# EAGLE schematic Titan_Teknic_v1p01b (EAGLE 9.6.2)
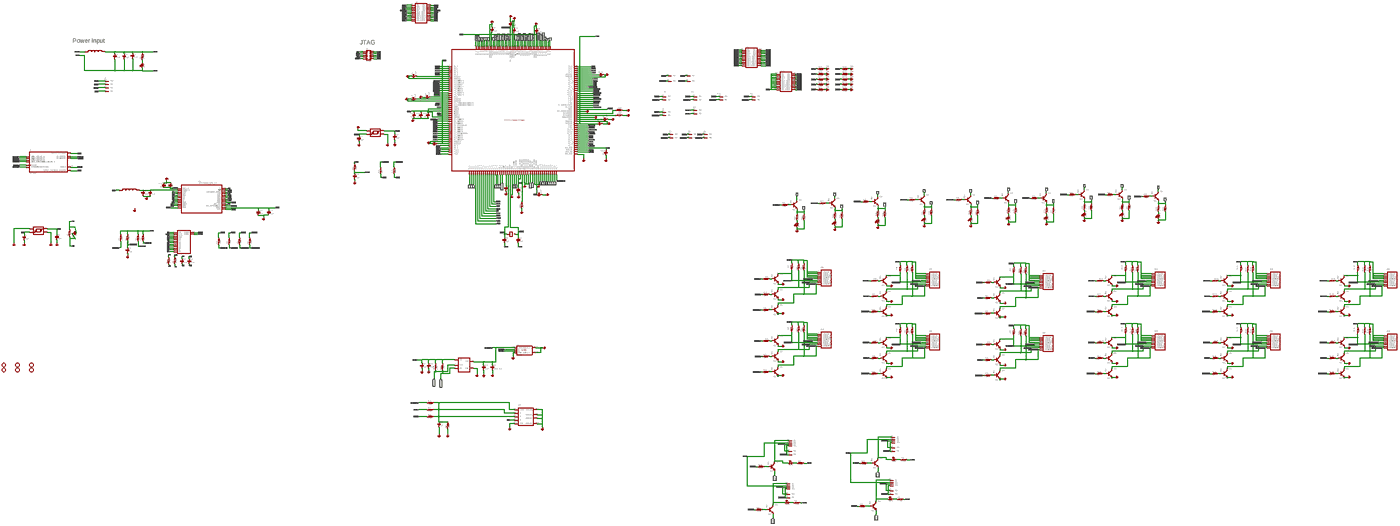
[diagram p0: schematic, sheet 1, overview]
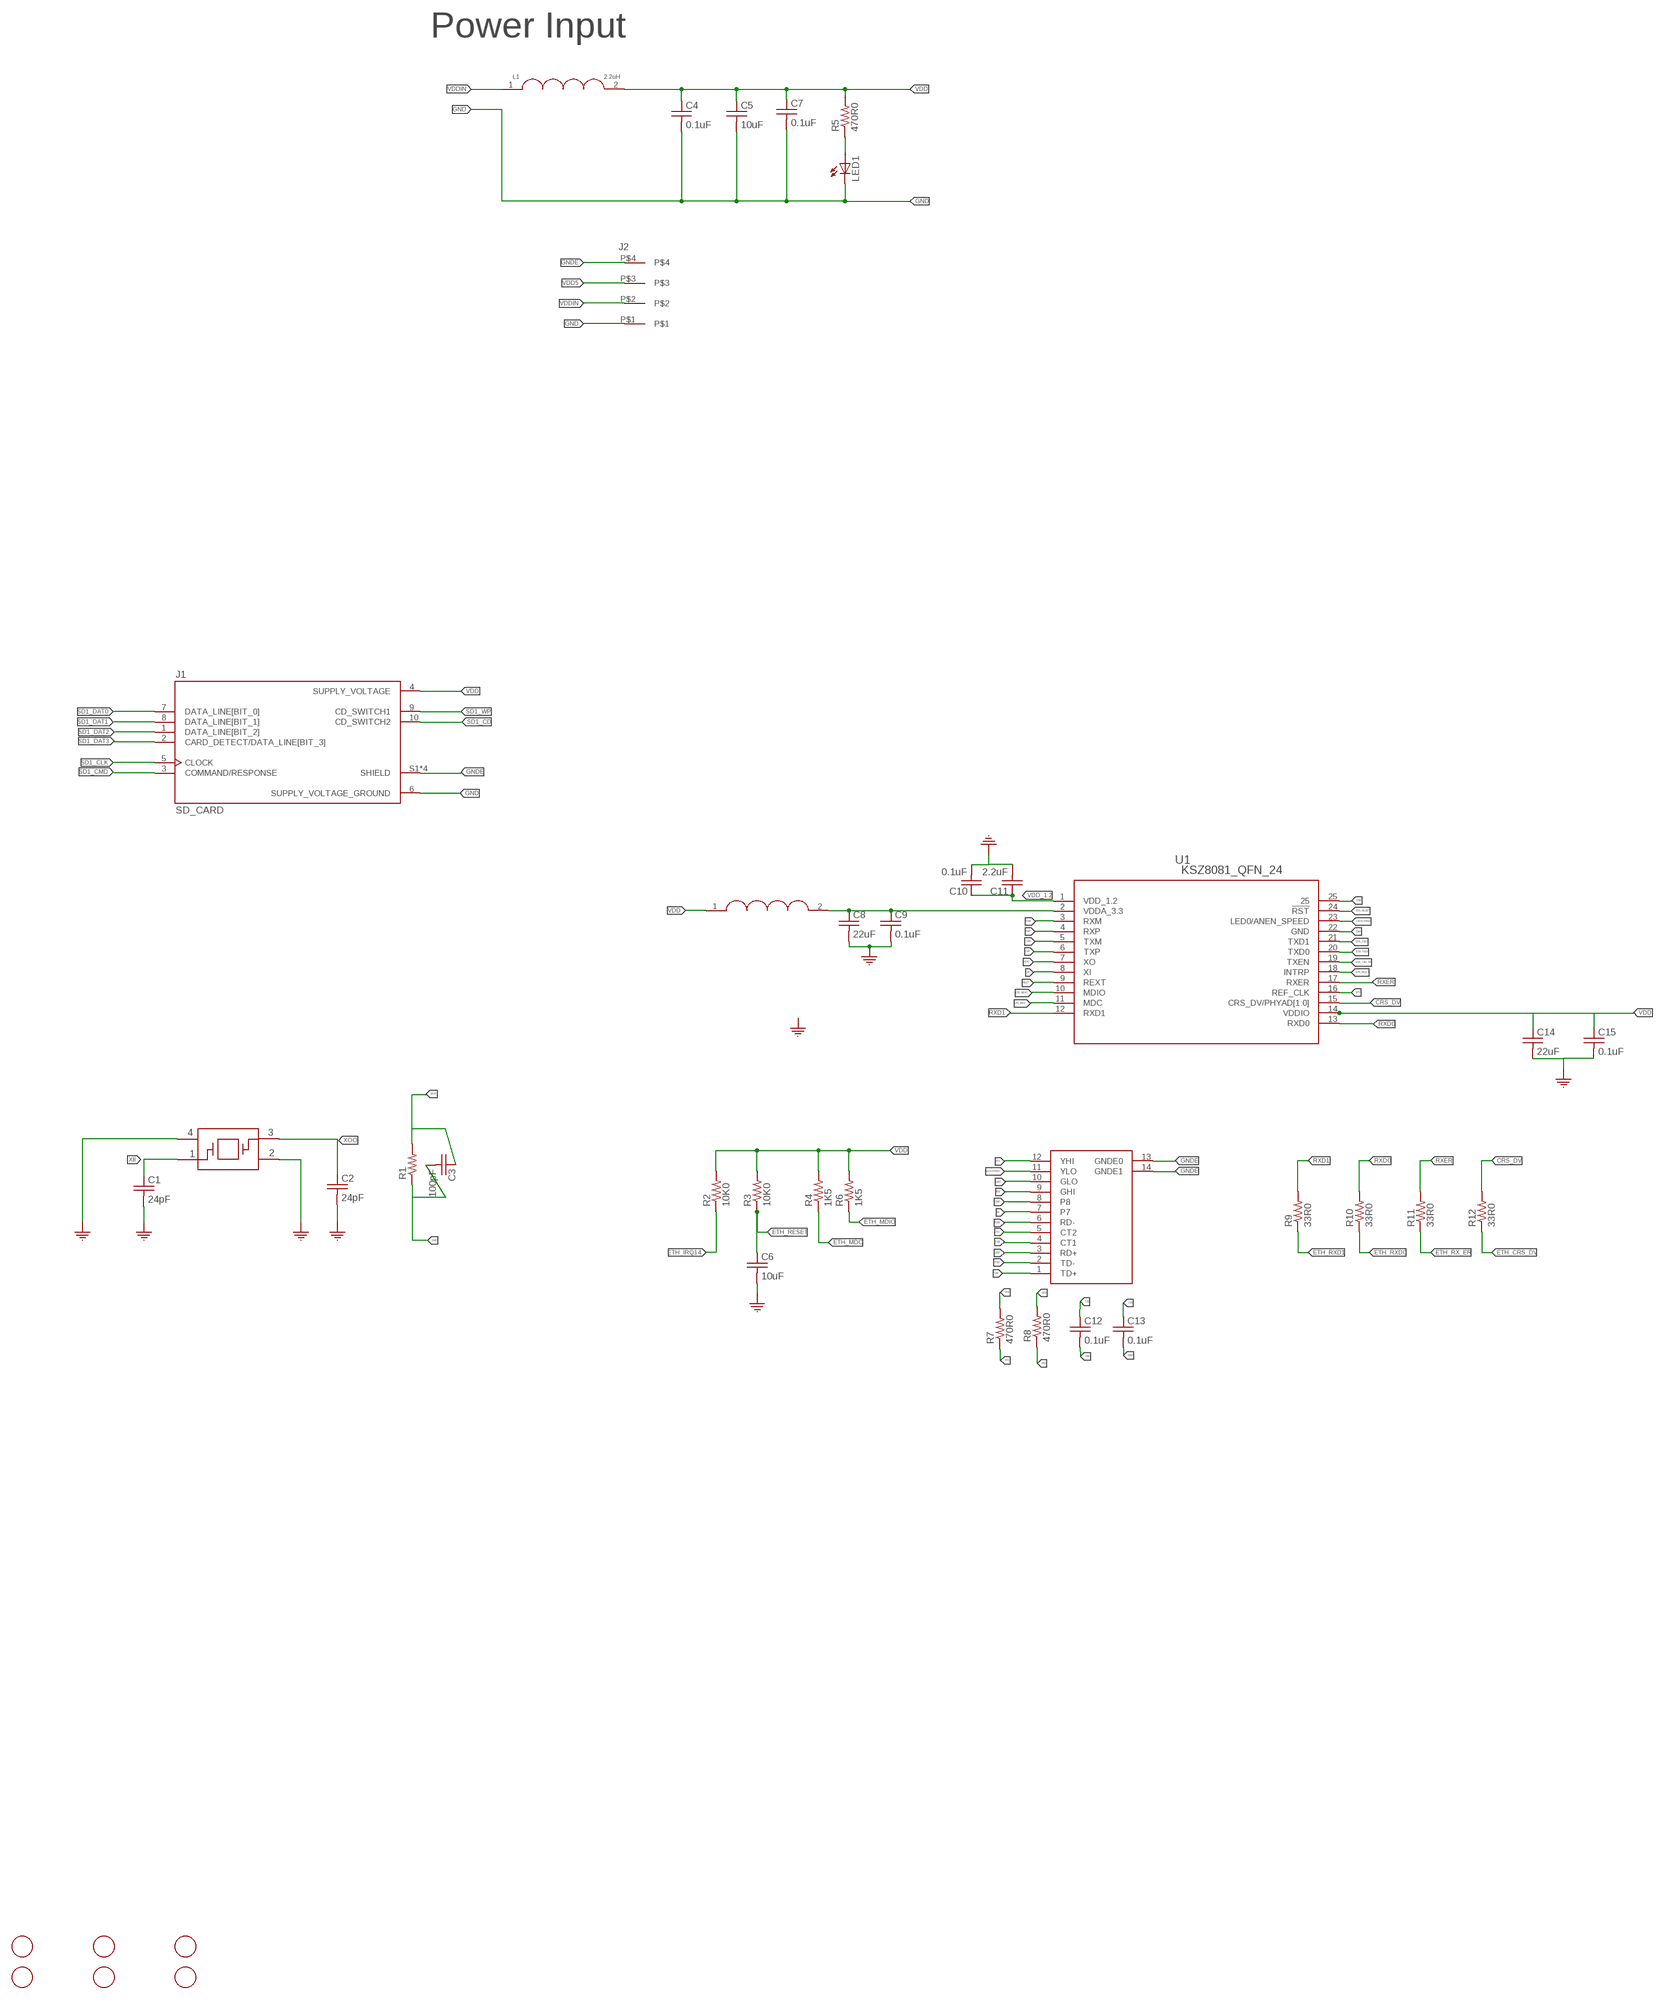
[diagram p1: schematic, sheet 1, part 1 of 6]
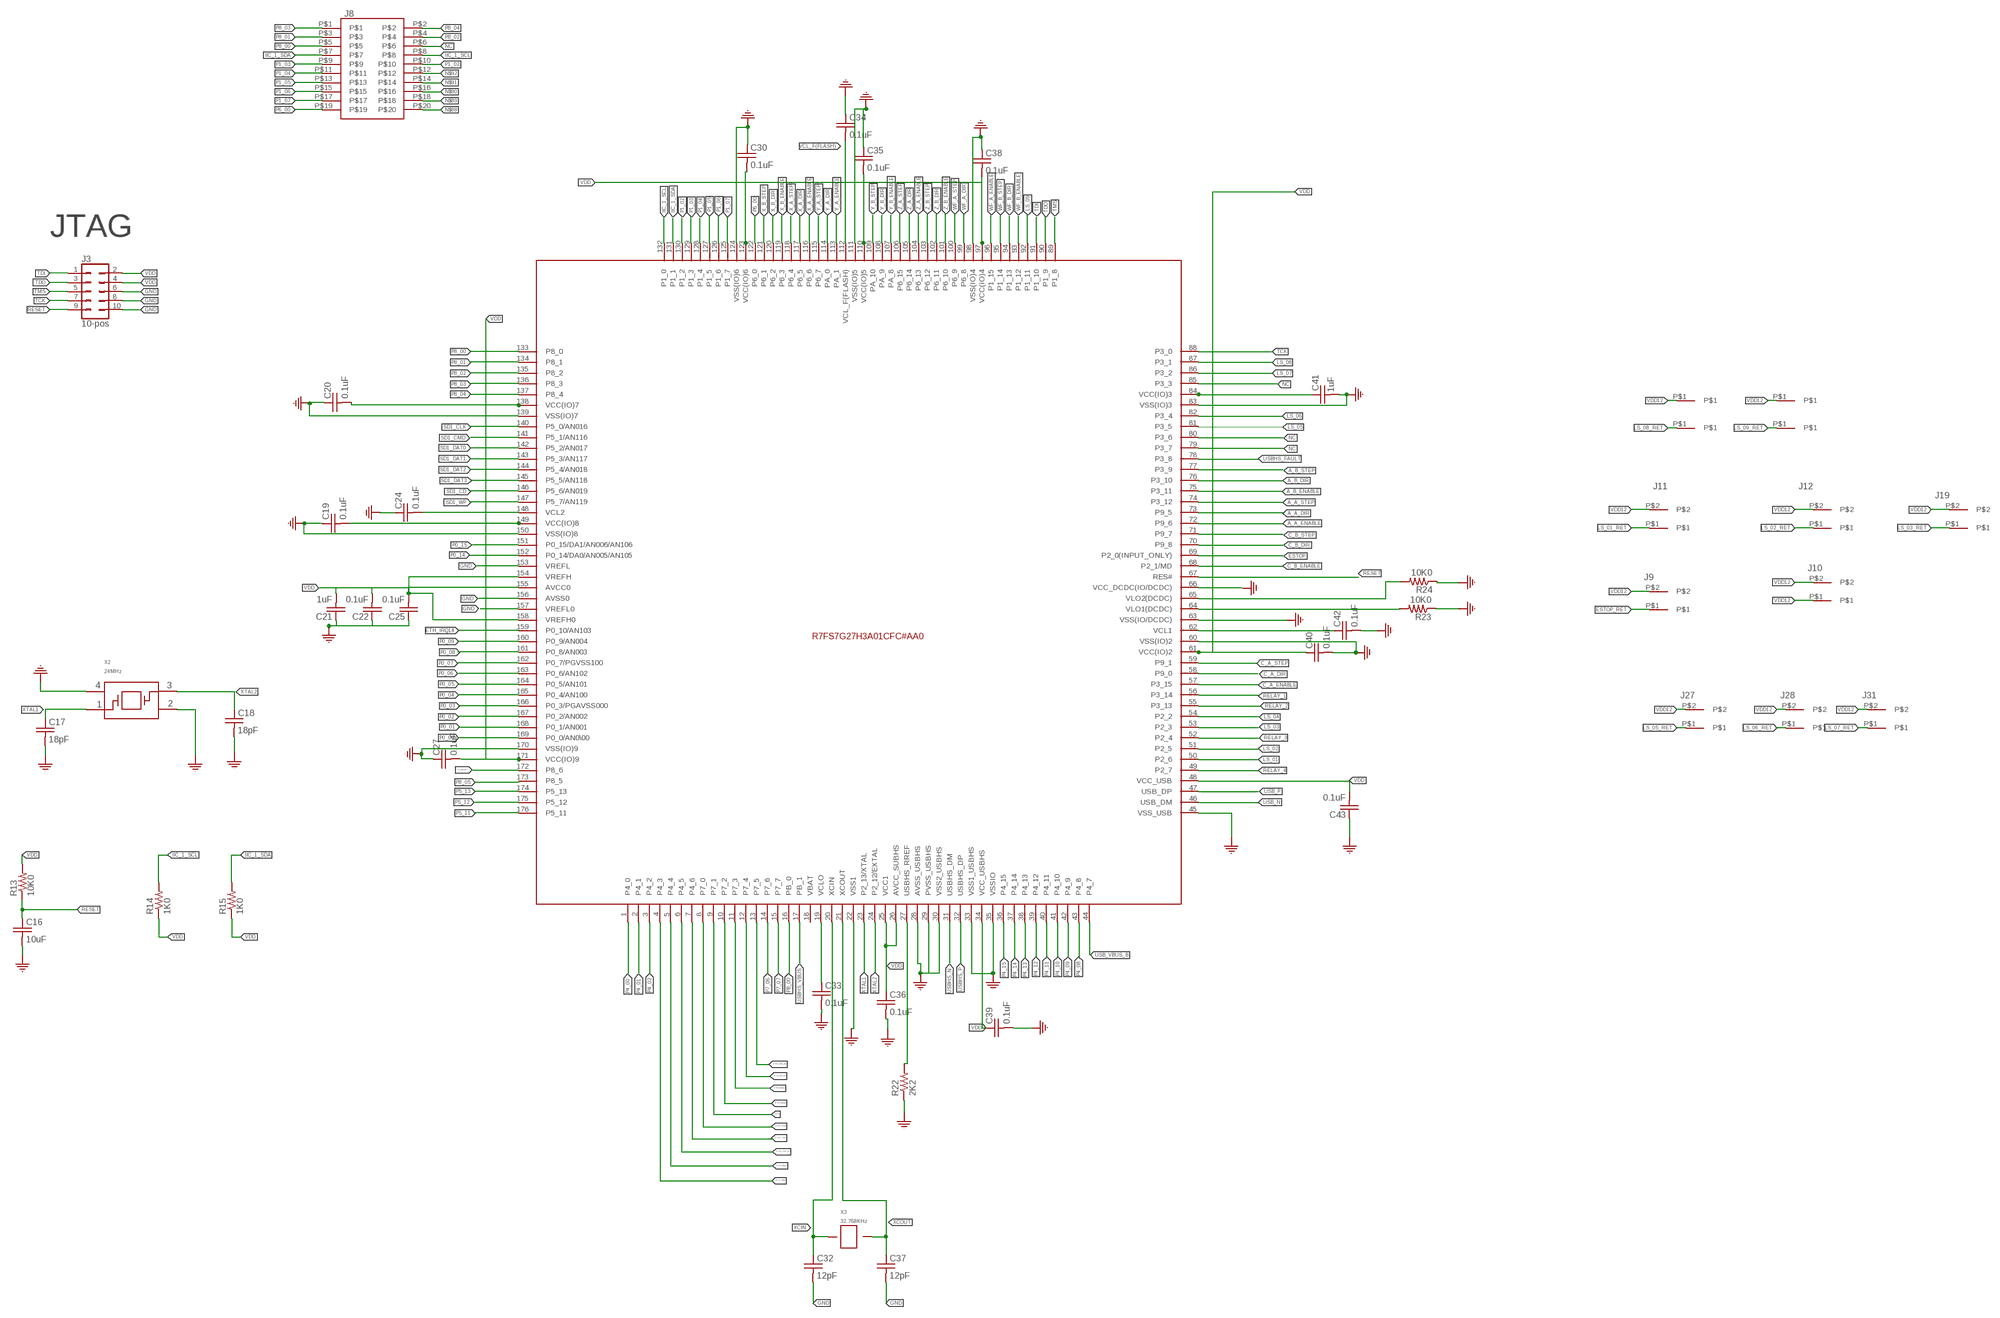
[diagram p2: schematic, sheet 1, part 2 of 6]
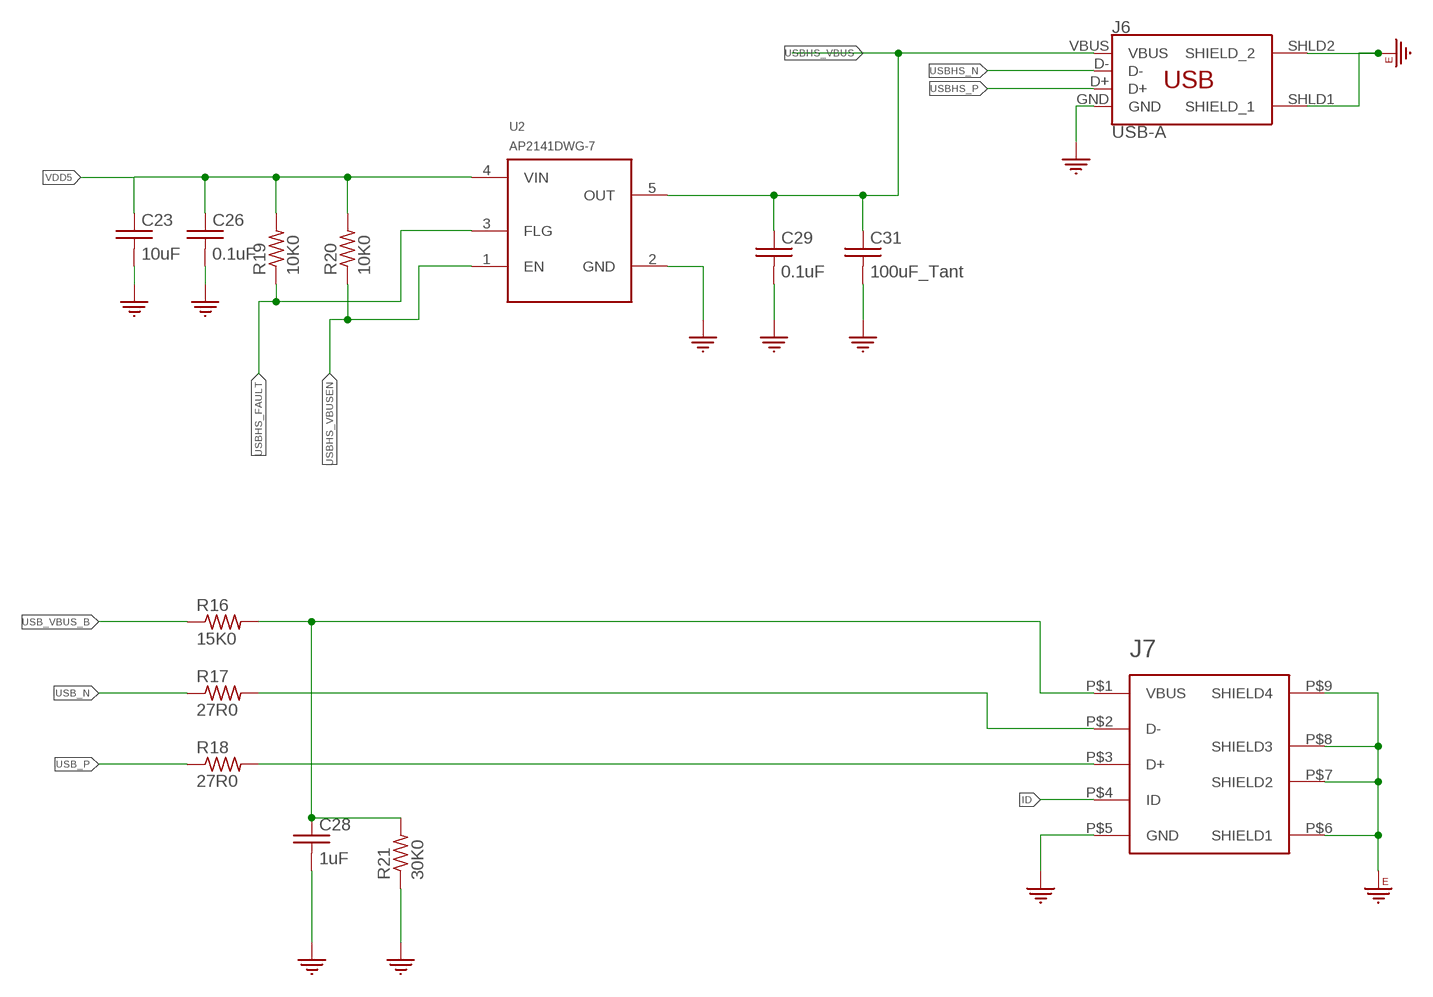
[diagram p3: schematic, sheet 1, part 3 of 6]
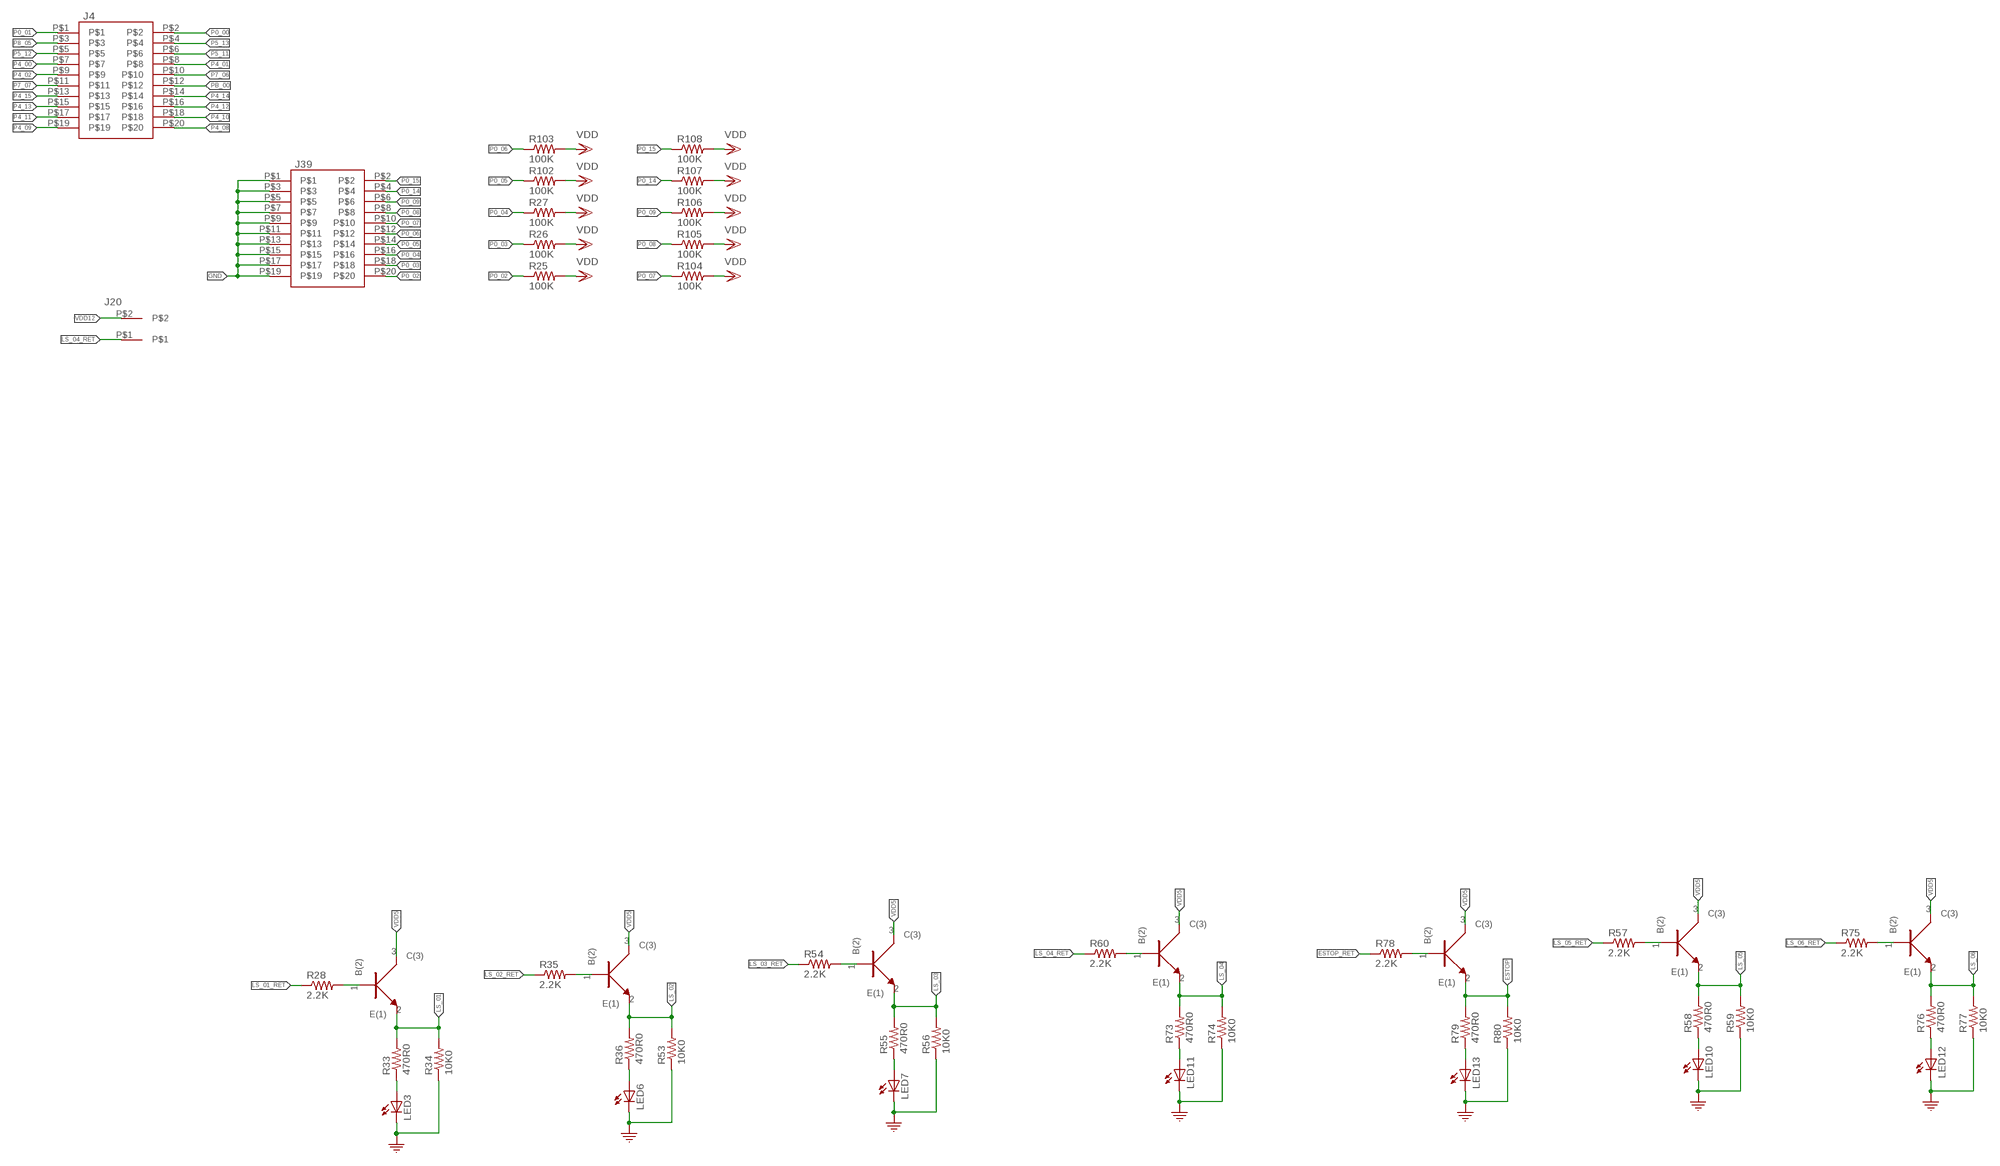
[diagram p4: schematic, sheet 1, part 4 of 6]
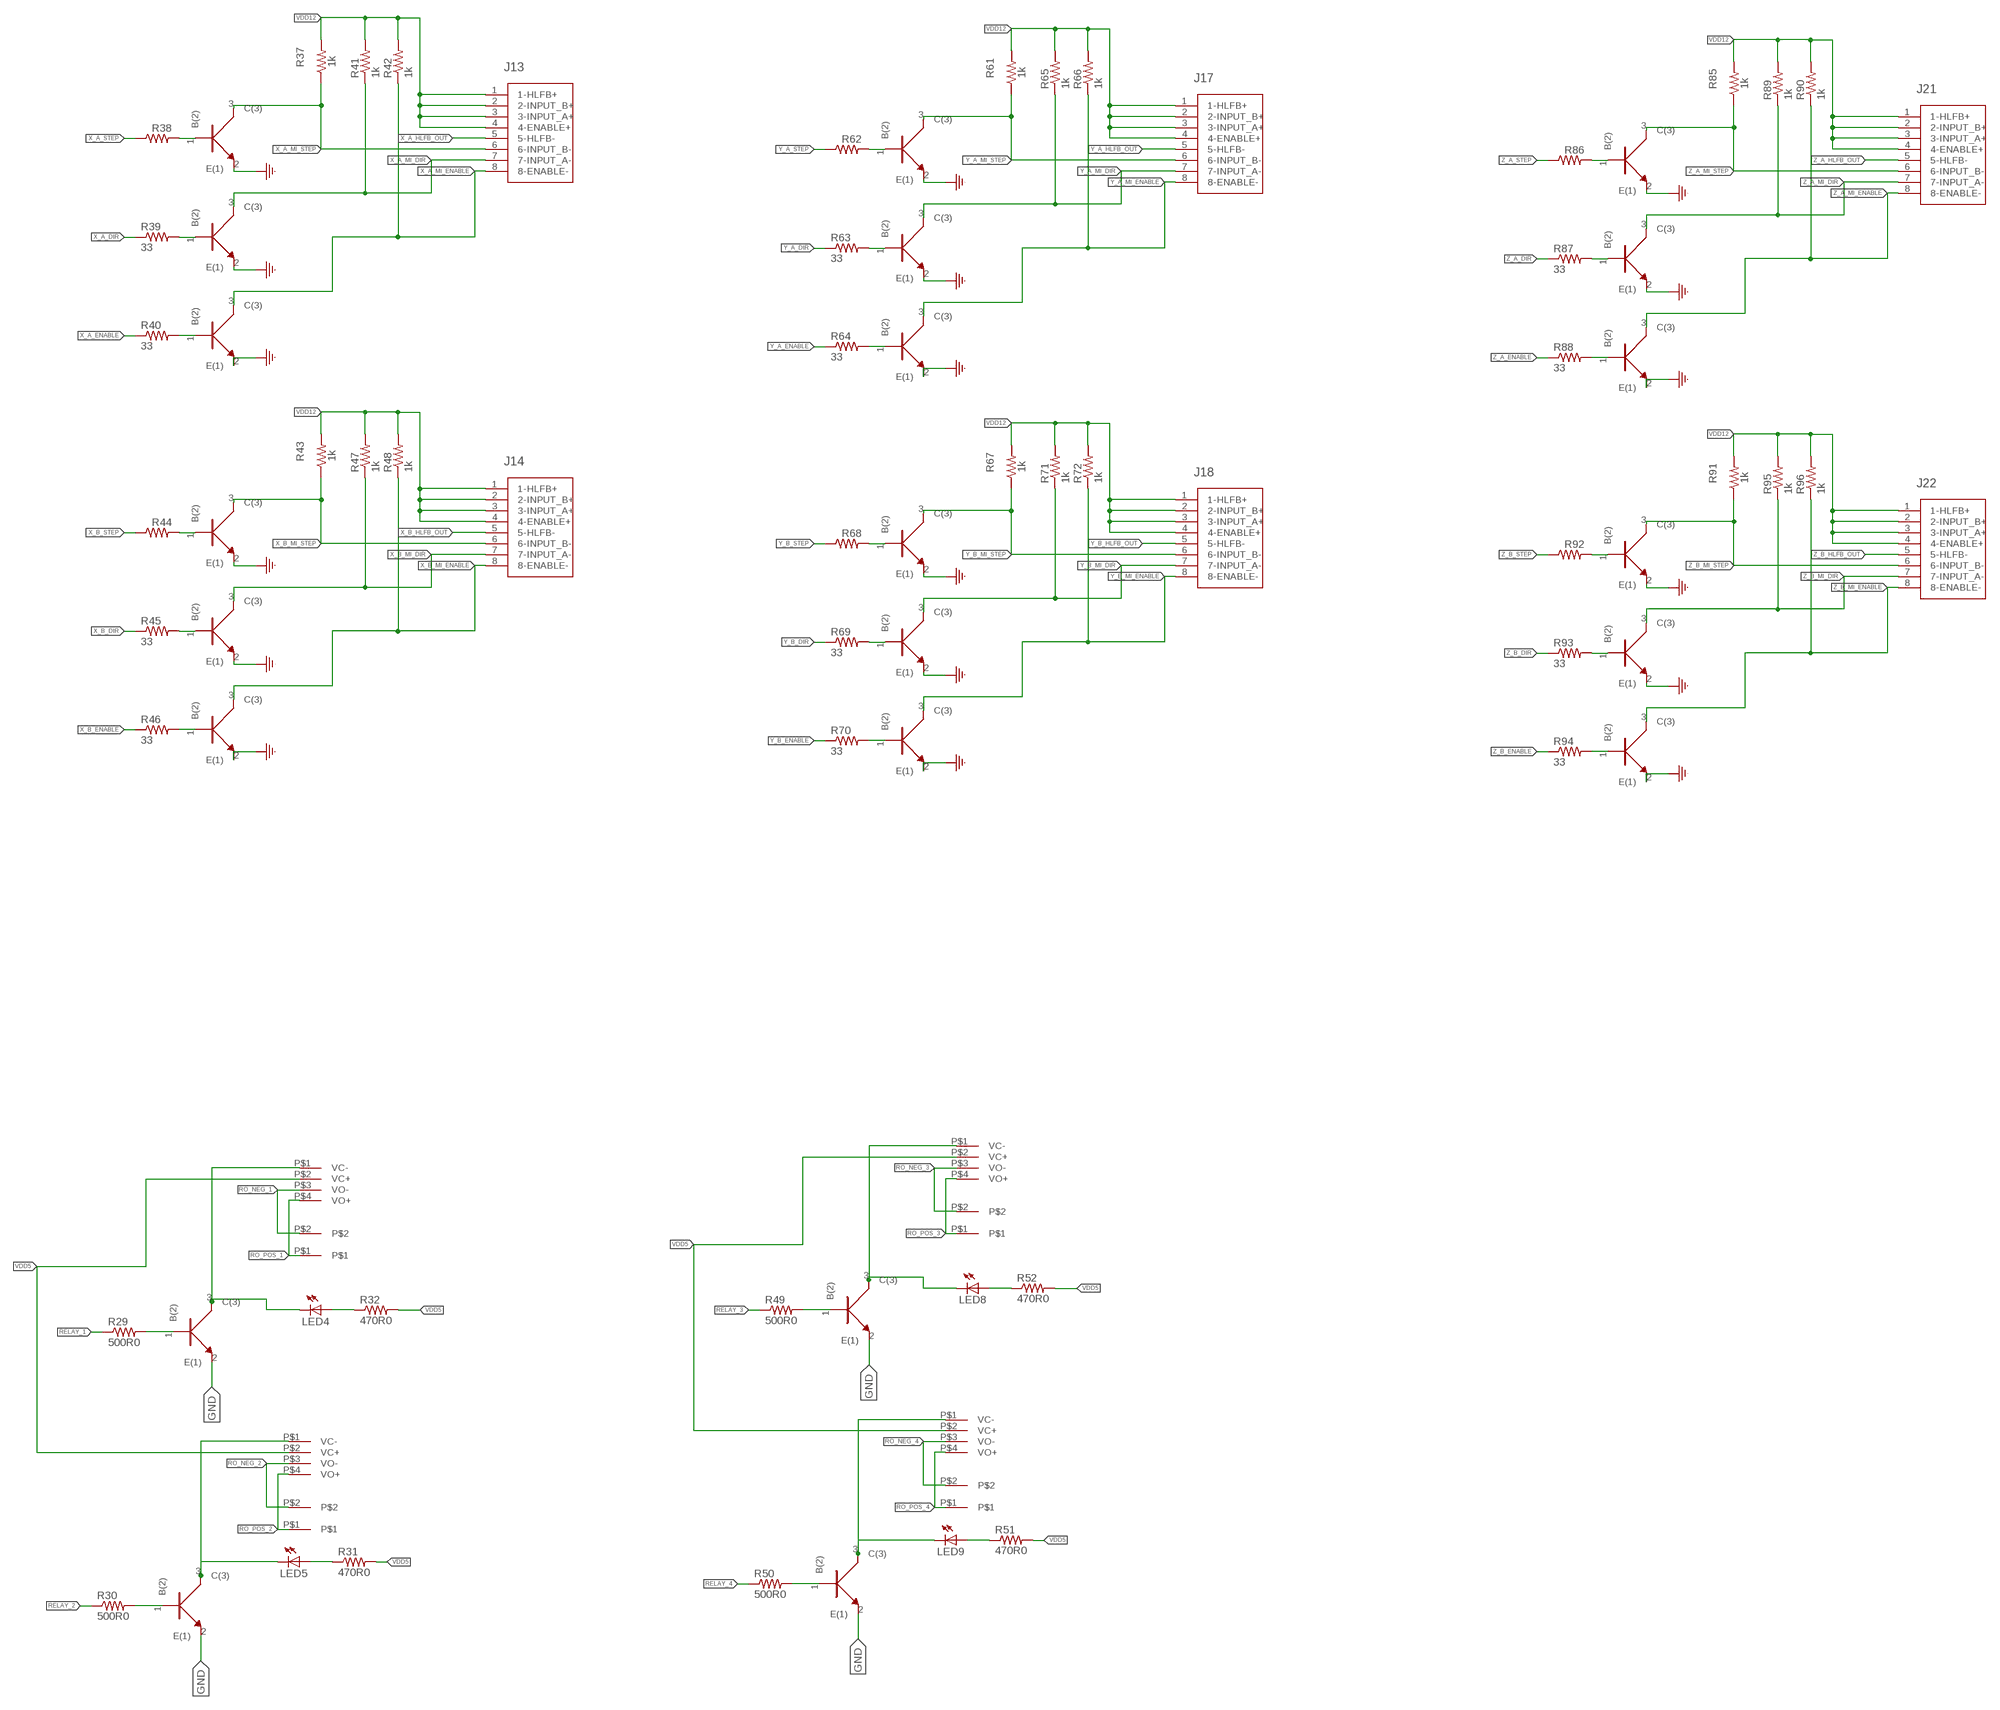
[diagram p5: schematic, sheet 1, part 5 of 6]
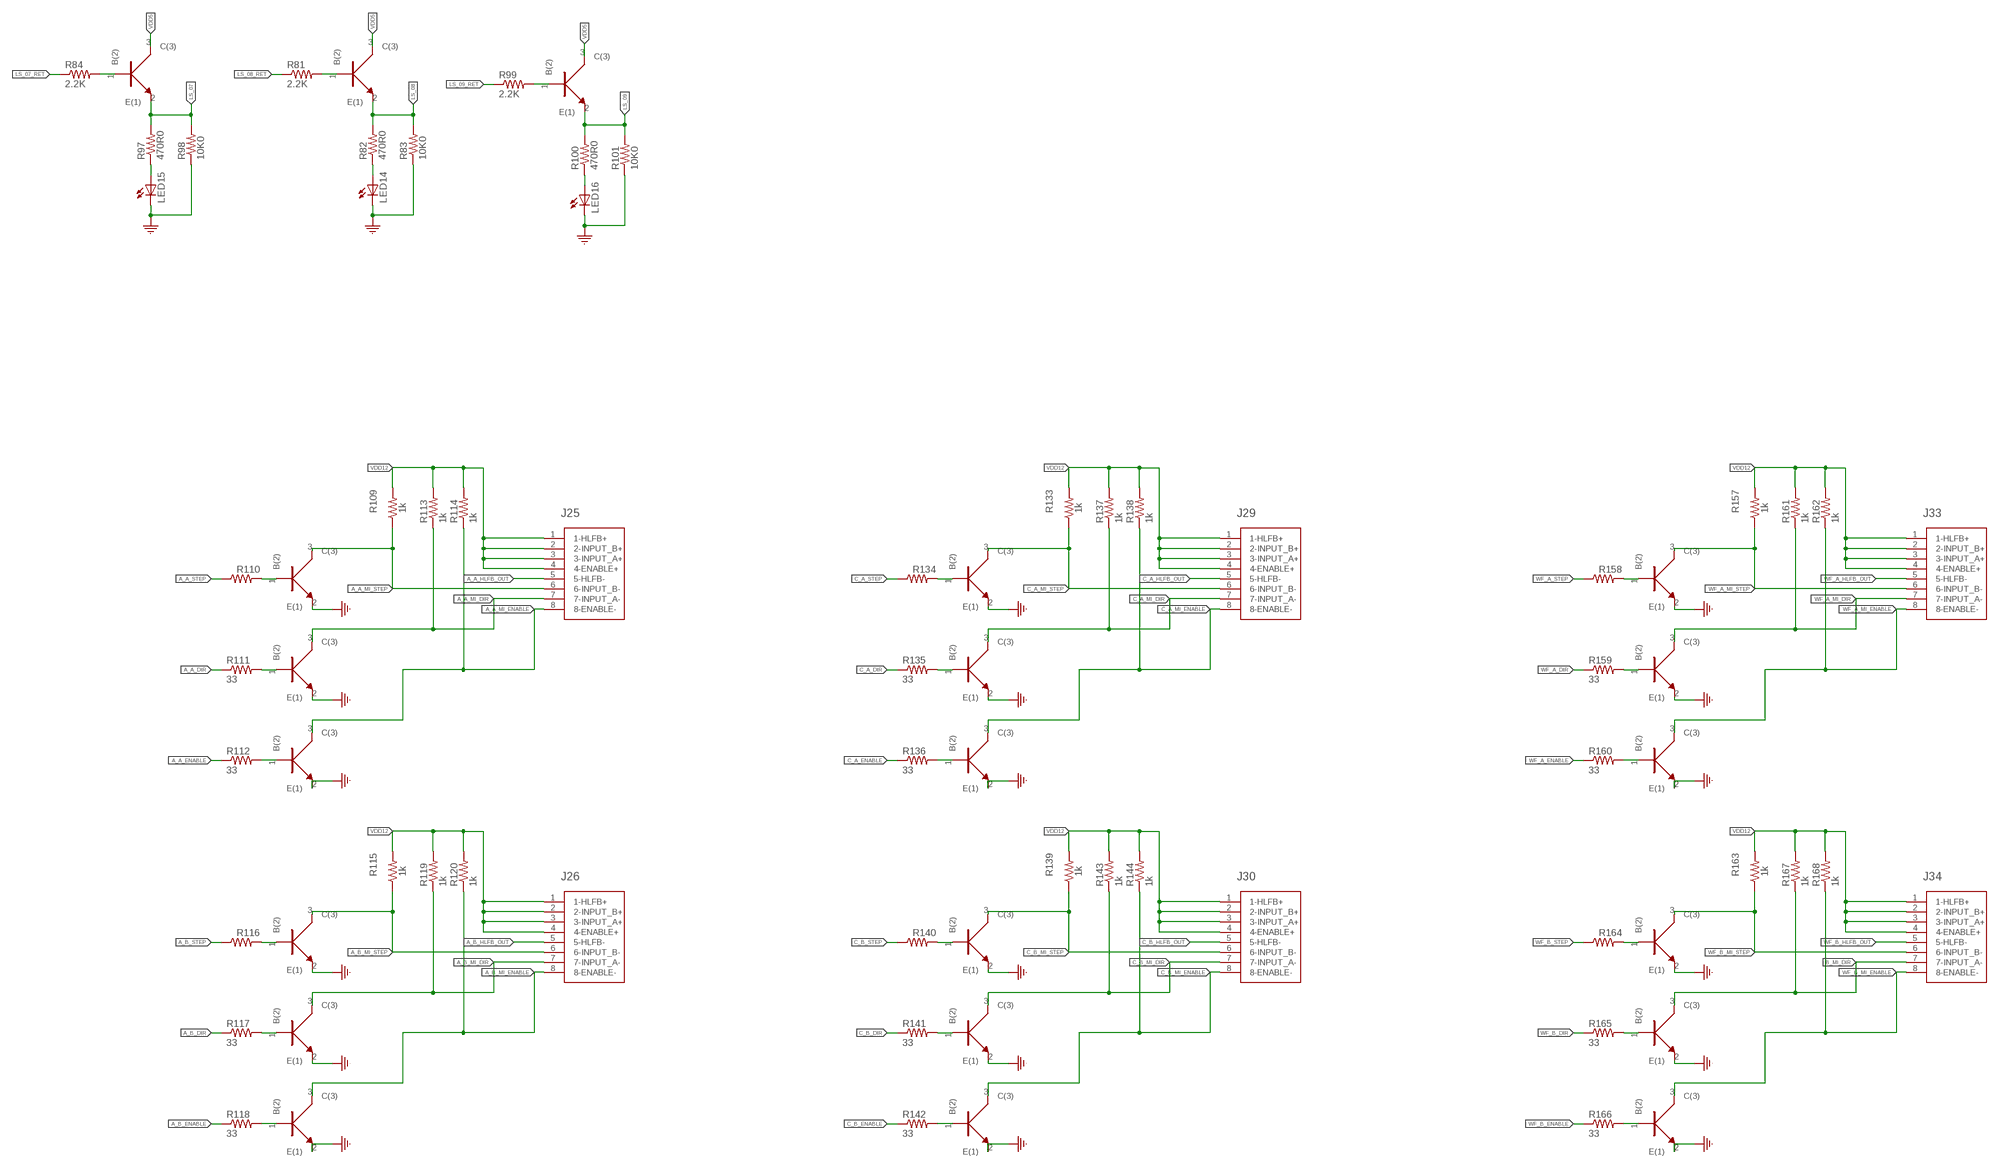
[diagram p6: schematic, sheet 1, part 6 of 6]

## Parts
AFID1  FIDUCIAL_1MM  [FIDUCIAL_1MM]
AFID2  FIDUCIAL_1MM  [FIDUCIAL_1MM]
AFID3  FIDUCIAL_1MM  [FIDUCIAL_1MM]
AFID4  FIDUCIAL_1MM  [FIDUCIAL_1MM]
AFID5  FIDUCIAL_1MM  [FIDUCIAL_1MM]
AFID6  FIDUCIAL_1MM  [FIDUCIAL_1MM]
C1  24pF  C_0402_24PF  [0402]
C2  24pF  C_0402_24PF  [0402]
C3  100pF  C_0402_100PF  [0402]
C4  0.1uF  C_0402_0.1UF  [0402]
C5  10uF  C_0402_10UF  [0402]
C6  10uF  C_0402_10UF  [0402]
C7  0.1uF  C_0402_0.1UF  [0402]
C8  22uF  C_0402_22UF  [0402]
C9  0.1uF  C_0402_0.1UF  [0402]
C10  0.1uF  C_0402_0.1UF  [0402]
C11  2.2uF  C_0402_2.2UF  [0402]
C12  0.1uF  C_0402_0.1UF  [0402]
C13  0.1uF  C_0402_0.1UF  [0402]
C14  22uF  C_0402_22UF  [0402]
C15  0.1uF  C_0402_0.1UF  [0402]
C16  10uF  C_0402_10UF  [0402]
C17  18pF  C_0402_18PF  [0402]
C18  18pF  C_0402_18PF  [0402]
C19  0.1uF  C_0402_0.1UF  [0402]
C20  0.1uF  C_0402_0.1UF  [0402]
C21  1uF  C_0402_1UF  [0402]
C22  0.1uF  C_0402_0.1UF  [0402]
C23  10uF  C_0402_10UF  [0402]
C24  0.1uF  C_0402_0.1UF  [0402]
C25  0.1uF  C_0402_0.1UF  [0402]
C26  0.1uF  C_0402_0.1UF  [0402]
C27  0.1uF  C_0402_0.1UF  [0402]
C28  1uF  C_0402_1UF  [0402]
C29  0.1uF  C_0402_0.1UF  [0402]
C30  0.1uF  C_0402_0.1UF  [0402]
C31  100uF_Tant  C_1210_100UF_TANT  [C1210]
C32  12pF  C_0402_12PF  [0402]
C33  0.1uF  C_0402_0.1UF  [0402]
C34  0.1uF  C_0402_0.1UF  [0402]
C35  0.1uF  C_0402_0.1UF  [0402]
C36  0.1uF  C_0402_0.1UF  [0402]
C37  12pF  C_0402_12PF  [0402]
C38  0.1uF  C_0402_0.1UF  [0402]
C39  0.1uF  C_0402_0.1UF  [0402]
C40  0.1uF  C_0402_0.1UF  [0402]
C41  1uF  C_0402_1UF  [0402]
C42  0.1uF  C_0402_0.1UF  [0402]
C43  0.1uF  C_0402_0.1UF  [0402]
FB1  FB2_603  FB_0603_120_OHM0603  [0603]
J1  SD_CARD  SD_CARD_1140084168  [SD_CARD]
J2  4-pos  3.81MM_1_X_4_RT_ANGLE_PLUG_HEADER  [1X4_3.81MM_PITCH]
J3  10-pos  CONN_05X2_RAPTH  [2X5]
J4  20-pos  2_X_10_HEADER_GENERIC  [2_X_10_.1_INCH]
J6  USB-A  USB_A  [USB_A_SMT]
J7  USB-B-Micro  USB_MICRO-B  [USB_MICRO-B]
J8  2_X_10_HEADER_GENERIC  [2_X_10_.1_INCH]
J9  2-pos  3.81MM_1_X_2_RT_ANGLE_PLUG_HEADER  [2_3.81MM_PITCH]
J10  2-pos  3.81MM_1_X_2_RT_ANGLE_PLUG_HEADER  [2_3.81MM_PITCH]
J11  2-pos  3.81MM_1_X_2_RT_ANGLE_PLUG_HEADER  [2_3.81MM_PITCH]
J12  2-pos  3.81MM_1_X_2_RT_ANGLE_PLUG_HEADER  [2_3.81MM_PITCH]
J13  TEKNIC_MOTOR_8PIN  [CON_39281083]
J14  TEKNIC_MOTOR_8PIN  [CON_39281083]
J15  2-pos  3.81MM_1_X_2_RT_ANGLE_PLUG_HEADER  [2_3.81MM_PITCH]
J16  2-pos  3.81MM_1_X_2_RT_ANGLE_PLUG_HEADER  [2_3.81MM_PITCH]
J17  TEKNIC_MOTOR_8PIN  [CON_39281083]
J18  TEKNIC_MOTOR_8PIN  [CON_39281083]
J19  2-pos  3.81MM_1_X_2_RT_ANGLE_PLUG_HEADER  [2_3.81MM_PITCH]
J20  2-pos  3.81MM_1_X_2_RT_ANGLE_PLUG_HEADER  [2_3.81MM_PITCH]
J21  TEKNIC_MOTOR_8PIN  [CON_39281083]
J22  TEKNIC_MOTOR_8PIN  [CON_39281083]
J23  2-pos  3.81MM_1_X_2_RT_ANGLE_PLUG_HEADER  [2_3.81MM_PITCH]
J24  2-pos  3.81MM_1_X_2_RT_ANGLE_PLUG_HEADER  [2_3.81MM_PITCH]
J25  TEKNIC_MOTOR_8PIN  [CON_39281083]
J26  TEKNIC_MOTOR_8PIN  [CON_39281083]
J27  2-pos  3.81MM_1_X_2_RT_ANGLE_PLUG_HEADER  [2_3.81MM_PITCH]
J28  2-pos  3.81MM_1_X_2_RT_ANGLE_PLUG_HEADER  [2_3.81MM_PITCH]
J29  TEKNIC_MOTOR_8PIN  [CON_39281083]
J30  TEKNIC_MOTOR_8PIN  [CON_39281083]
J31  2-pos  3.81MM_1_X_2_RT_ANGLE_PLUG_HEADER  [2_3.81MM_PITCH]
J33  TEKNIC_MOTOR_8PIN  [CON_39281083]
J34  TEKNIC_MOTOR_8PIN  [CON_39281083]
J39  2_X_10_HEADER_GENERIC  [2_X_10_.1_INCH]
L1  2.2uH  INDUCTOR_1008_2.2_MH_1.3A  [1008]
LED1  Green  LED_0805_GREEN  [0805]
LED3  Green  LED_0805_GREEN  [0805]
LED4  Green  LED_0805_GREEN  [0805]
LED5  Green  LED_0805_GREEN  [0805]
LED6  Green  LED_0805_GREEN  [0805]
LED7  Green  LED_0805_GREEN  [0805]
LED8  Green  LED_0805_GREEN  [0805]
LED9  Green  LED_0805_GREEN  [0805]
LED10  Green  LED_0805_GREEN  [0805]
LED11  Green  LED_0805_GREEN  [0805]
LED12  Green  LED_0805_GREEN  [0805]
LED13  Green  LED_0805_GREEN  [0805]
LED14  Green  LED_0805_GREEN  [0805]
LED15  Green  LED_0805_GREEN  [0805]
LED16  Green  LED_0805_GREEN  [0805]
P1  1_X_1_1MM_PIN  [1_X_1_1MM_PIN]
P2  1_X_1_1MM_PIN  [1_X_1_1MM_PIN]
P3  1_X_1_1MM_PIN  [1_X_1_1MM_PIN]
P4  1_X_1_1MM_PIN  [1_X_1_1MM_PIN]
R1  6K49  R_0402_6K49  [0402]
R2  10K0  R_0402_10K0  [0402]
R3  10K0  R_0402_10K0  [0402]
R4  1K5  R_0402_1K5  [0402]
R5  470R0  R_0402_470R0  [0402]
R6  1K5  R_0402_1K5  [0402]
R7  470R0  R_0402_470R0  [0402]
R8  470R0  R_0402_470R0  [0402]
R9  33R0  R_0402_33R0  [0402]
R10  33R0  R_0402_33R0  [0402]
R11  33R0  R_0402_33R0  [0402]
R12  33R0  R_0402_33R0  [0402]
R13  10K0  R_0402_10K0  [0402]
R14  1K0  R_0402_1K0  [0402]
R15  1K0  R_0402_1K0  [0402]
R16  15K0  R_0402_15K0  [0402]
R17  27R0  R_0402_27R0  [0402]
R18  27R0  R_0402_27R0  [0402]
R19  10K0  R_0402_10K0  [0402]
R20  10K0  R_0402_10K0  [0402]
R21  30K0  R_0402_30K0  [0402]
R22  2K2  R_0402_2K2  [0402]
R23  10K0  R_0402_10K0  [0402]
R24  10K0  R_0402_10K0  [0402]
R25  100K  R_0402  [0402]
R26  100K  R_0402  [0402]
R27  100K  R_0402  [0402]
R28  2.2K  R_0402  [0402]
R29  500R0  R_0402  [0402]
R30  500R0  R_0402  [0402]
R31  470R0  R_0402_470R0  [0402]
R32  470R0  R_0402_470R0  [0402]
R33  470R0  R_0402_470R0  [0402]
R34  10K0  R_0402_10K0  [0402]
R35  2.2K  R_0402  [0402]
R36  470R0  R_0402_470R0  [0402]
R37  1k  R_0805  [0805]
R38  33  R_0805  [0805]
R39  33  R_0805  [0805]
R40  33  R_0805  [0805]
R41  1k  R_0805  [0805]
R42  1k  R_0805  [0805]
R43  1k  R_0805  [0805]
R44  33  R_0805  [0805]
R45  33  R_0805  [0805]
R46  33  R_0805  [0805]
R47  1k  R_0805  [0805]
R48  1k  R_0805  [0805]
R49  500R0  R_0402  [0402]
R50  500R0  R_0402  [0402]
R51  470R0  R_0402_470R0  [0402]
R52  470R0  R_0402_470R0  [0402]
R53  10K0  R_0402_10K0  [0402]
R54  2.2K  R_0402  [0402]
R55  470R0  R_0402_470R0  [0402]
R56  10K0  R_0402_10K0  [0402]
R57  2.2K  R_0402  [0402]
R58  470R0  R_0402_470R0  [0402]
R59  10K0  R_0402_10K0  [0402]
R60  2.2K  R_0402  [0402]
R61  1k  R_0805  [0805]
R62  33  R_0805  [0805]
R63  33  R_0805  [0805]
R64  33  R_0805  [0805]
R65  1k  R_0805  [0805]
R66  1k  R_0805  [0805]
R67  1k  R_0805  [0805]
R68  33  R_0805  [0805]
R69  33  R_0805  [0805]
R70  33  R_0805  [0805]
R71  1k  R_0805  [0805]
R72  1k  R_0805  [0805]
R73  470R0  R_0402_470R0  [0402]
R74  10K0  R_0402_10K0  [0402]
R75  2.2K  R_0402  [0402]
R76  470R0  R_0402_470R0  [0402]
R77  10K0  R_0402_10K0  [0402]
R78  2.2K  R_0402  [0402]
R79  470R0  R_0402_470R0  [0402]
R80  10K0  R_0402_10K0  [0402]
R81  2.2K  R_0402  [0402]
R82  470R0  R_0402_470R0  [0402]
R83  10K0  R_0402_10K0  [0402]
R84  2.2K  R_0402  [0402]
R85  1k  R_0805  [0805]
R86  33  R_0805  [0805]
R87  33  R_0805  [0805]
R88  33  R_0805  [0805]
R89  1k  R_0805  [0805]
R90  1k  R_0805  [0805]
R91  1k  R_0805  [0805]
R92  33  R_0805  [0805]
R93  33  R_0805  [0805]
R94  33  R_0805  [0805]
R95  1k  R_0805  [0805]
R96  1k  R_0805  [0805]
R97  470R0  R_0402_470R0  [0402]
R98  10K0  R_0402_10K0  [0402]
R99  2.2K  R_0402  [0402]
R100  470R0  R_0402_470R0  [0402]
R101  10K0  R_0402_10K0  [0402]
R102  100K  R_0402  [0402]
R103  100K  R_0402  [0402]
R104  100K  R_0402  [0402]
R105  100K  R_0402  [0402]
R106  100K  R_0402  [0402]
R107  100K  R_0402  [0402]
R108  100K  R_0402  [0402]
R109  1k  R_0805  [0805]
R110  33  R_0805  [0805]
R111  33  R_0805  [0805]
R112  33  R_0805  [0805]
R113  1k  R_0805  [0805]
R114  1k  R_0805  [0805]
R115  1k  R_0805  [0805]
R116  33  R_0805  [0805]
R117  33  R_0805  [0805]
R118  33  R_0805  [0805]
R119  1k  R_0805  [0805]
R120  1k  R_0805  [0805]
R133  1k  R_0805  [0805]
R134  33  R_0805  [0805]
R135  33  R_0805  [0805]
R136  33  R_0805  [0805]
R137  1k  R_0805  [0805]
R138  1k  R_0805  [0805]
R139  1k  R_0805  [0805]
R140  33  R_0805  [0805]
R141  33  R_0805  [0805]
R142  33  R_0805  [0805]
R143  1k  R_0805  [0805]
R144  1k  R_0805  [0805]
R157  1k  R_0805  [0805]
R158  33  R_0805  [0805]
R159  33  R_0805  [0805]
R160  33  R_0805  [0805]
R161  1k  R_0805  [0805]
R162  1k  R_0805  [0805]
R163  1k  R_0805  [0805]
R164  33  R_0805  [0805]
R165  33  R_0805  [0805]
R166  33  R_0805  [0805]
R167  1k  R_0805  [0805]
R168  1k  R_0805  [0805]
RJ1  RJ45  RJ45_WITH_ELEC  [RJ45_TH_ELEC]
U1  KSZ8081_QFN_24  KSZ8081RNACAQFN-24-M  [QFN-24-M]
U2  AP2151DWG-7  [SOT-23-5]
U3  S7G2LQFP176  RENESAS_S7G2_X_176  [LQFP176_24X24]
U5  NPN  BC846BW  [SOT323]
U6  NPN  BC846BW  [SOT323]
U7  NPN  BC846BW  [SOT323]
U8  NPN  BC846BW  [SOT323]
U9  NPN  BC846BW  [SOT323]
U10  NPN  BC846BW  [SOT323]
U11  NPN  BC846BW  [SOT323]
U12  NPN  BC846BW  [SOT323]
U13  NPN  BC846BW  [SOT323]
U14  NPN  BC846BW  [SOT323]
U15  NPN  BC846BW  [SOT323]
U16  NPN  BC846BW  [SOT323]
U17  NPN  BC846BW  [SOT323]
U18  NPN  BC846BW  [SOT323]
U19  NPN  BC846BW  [SOT323]
U20  NPN  BC846BW  [SOT323]
U21  NPN  BC846BW  [SOT323]
U22  NPN  BC846BW  [SOT323]
U23  NPN  BC846BW  [SOT323]
U24  NPN  BC846BW  [SOT323]
U25  NPN  BC846BW  [SOT323]
U26  NPN  BC846BW  [SOT323]
U27  NPN  BC846BW  [SOT323]
U28  NPN  BC846BW  [SOT323]
U29  NPN  BC846BW  [SOT323]
U30  NPN  BC846BW  [SOT323]
U34  NPN  BC846BW  [SOT323]
U35  NPN  BC846BW  [SOT323]
U36  NPN  BC846BW  [SOT323]
U37  NPN  BC846BW  [SOT323]
U38  NPN  BC846BW  [SOT323]
U39  NPN  BC846BW  [SOT323]
U46  NPN  BC846BW  [SOT323]
U47  NPN  BC846BW  [SOT323]
U48  NPN  BC846BW  [SOT323]
U49  NPN  BC846BW  [SOT323]
U50  NPN  BC846BW  [SOT323]
U51  NPN  BC846BW  [SOT323]
U58  NPN  BC846BW  [SOT323]
U59  NPN  BC846BW  [SOT323]
U60  NPN  BC846BW  [SOT323]
U61  NPN  BC846BW  [SOT323]
U62  NPN  BC846BW  [SOT323]
U63  NPN  BC846BW  [SOT323]
U70  NPN  BC846BW  [SOT323]
U71  NPN  BC846BW  [SOT323]
U72  NPN  BC846BW  [SOT323]
U73  NPN  BC846BW  [SOT323]
U74  NPN  BC846BW  [SOT323]
U75  NPN  BC846BW  [SOT323]
U$1  RELAY_KYOTO_KF0604D  [RELAY_KYOTO_KF0604D]
U$2  RELAY_KYOTO_KF0604D  [RELAY_KYOTO_KF0604D]
U$7  RELAY_KYOTO_KF0604D  [RELAY_KYOTO_KF0604D]
U$8  RELAY_KYOTO_KF0604D  [RELAY_KYOTO_KF0604D]
X1  25MHz  XTAL_25_MHZ  [SMD_3225]
X2  24MHz  XTAL_24_MHZ  [SMD_3225]
X3  32.768KHz  XTAL_32.768KHZ  [SMD_X_2_PADS]

## Nets
A_A_DIR: R111.1 U3.73(P9_5)
A_A_ENABLE: R112.1 U3.72(P9_6)
A_A_HLFB_OUT: J25.5(5-HLFB-)
A_A_MI_DIR: J25.7(7-INPUT_A-) R113.1 U47.3(C(3))
A_A_MI_ENABLE: J25.8(8-ENABLE-) R114.1 U48.3(C(3))
A_A_MI_STEP: J25.6(6-INPUT_B-) R109.1 U46.3(C(3))
A_A_STEP: R110.1 U3.74(P3_12)
A_B_DIR: R117.1 U3.76(P3_10)
A_B_ENABLE: R118.1 U3.75(P3_11)
A_B_HLFB_OUT: J26.5(5-HLFB-)
A_B_MI_DIR: J26.7(7-INPUT_A-) R119.1 U50.3(C(3))
A_B_MI_ENABLE: J26.8(8-ENABLE-) R120.1 U51.3(C(3))
A_B_MI_STEP: J26.6(6-INPUT_B-) R115.1 U49.3(C(3))
A_B_STEP: R116.1 U3.77(P3_9)
B_MI_DIR: J34.7(7-INPUT_A-) R167.1 U74.3(C(3))
C58: C12.P$1 RJ1.4(CT1)
C60: C13.P$1 RJ1.5(CT2)
C_A_DIR: R135.1 U3.58(P9_0)
C_A_ENABLE: R136.1 U3.57(P3_15)
C_A_HLFB_OUT: J29.5(5-HLFB-)
C_A_MI_DIR: J29.7(7-INPUT_A-) R137.1 U59.3(C(3))
C_A_MI_ENABLE: J29.8(8-ENABLE-) R138.1 U60.3(C(3))
C_A_MI_STEP: J29.6(6-INPUT_B-) R133.1 U58.3(C(3))
C_A_STEP: R134.1 U3.59(P9_1)
C_B_DIR: R141.1 U3.70(P9_8)
C_B_ENABLE: R142.1 U3.68(P2_1/MD)
C_B_HLFB_OUT: J30.5(5-HLFB-)
C_B_MI_DIR: J30.7(7-INPUT_A-) R143.1 U62.3(C(3))
C_B_MI_ENABLE: J30.8(8-ENABLE-) R144.1 U63.3(C(3))
C_B_MI_STEP: J30.6(6-INPUT_B-) R139.1 U61.3(C(3))
C_B_STEP: R140.1 U3.71(P9_7)
CRS_DV: R12.P$2 U1.15(CRS_DV/PHYAD[1:0])
D+: J7.P$3(D+) R18.P$2
D-: J7.P$2(D-) R17.P$2
ESTOP: R79.P$2 R80.P$2 U3.69(P2_0(INPUT_ONLY)) U21.2(E(1))
ESTOP_RET: J9.P$1 R78.P$1
ETH: U1.16(REF_CLK) U3.9(P7_1)
ETH_CRS_DV: R12.P$1 U3.13(P7_5)
ETH_IRQ14: R2.P$1 U1.18(INTRP) U3.159(P0_10/AN103)
ETH_MDC: R4.P$1 U1.11(MDC) U3.4(P4_3)
ETH_MDIO: R6.P$1 U1.10(MDIO) U3.5(P4_4)
ETH_RESET: C6.P$1 R3.P$1 U1.24(!RST) U3.172(P8_6)
ETH_RX_ER: R11.P$1 U3.12(P7_4)
ETH_RXD0: R10.P$1 U3.10(P7_2)
ETH_RXD1: R9.P$1 U3.11(P7_3)
ETH_TXD0: U1.20(TXD0) U3.8(P7_0)
ETH_TXD1: U1.21(TXD1) U3.7(P4_6)
ETH_TXD_EN: U1.19(TXEN) U3.6(P4_5)
GND: C1.P$2 C2.P$2 C3.P$2 C4.P$2 C5.P$2 C6.P$2 C7.P$2 C8.P$2 C9.P$2 C10.P$2 C11.P$2 C12.P$2 C13.P$2 C14.P$2 C15.P$2 C16.P$2 C17.P$2 C18.P$2 C19.P$1 C20.P$1 C21.P$1 C22.P$1 C23.P$2 C24.P$1 C25.P$1 C26.P$2 C27.P$1 C28.P$2 C29.P$2 C30.P$1 C31.2 C32.P$2 C33.P$2 C34.P$1 C35.P$1 C36.P$2 C37.P$2 C38.P$1 C39.P$2 C40.P$2 C41.P$2 C42.P$2 C43.P$1 J1.6(SUPPLY_VOLTAGE_GROUND) J2.P$1 J3.6 J3.8 J3.10 J6.GND J7.P$5(GND) J39.P$1 J39.P$3 J39.P$5 J39.P$7 J39.P$9 J39.P$11 J39.P$13 J39.P$15 J39.P$17 J39.P$19 LED1.2(C) LED3.2(C) LED6.2(C) LED7.2(C) LED10.2(C) LED11.2(C) LED12.2(C) LED13.2(C) LED14.2(C) LED15.2(C) LED16.2(C) R1.P$1 R21.P$1 R22.P$1 R23.P$1 R24.P$1 R34.P$1 R53.P$1 R56.P$1 R59.P$1 R74.P$1 R77.P$1 R80.P$1 R83.P$1 R98.P$1 R101.P$1 RJ1.8 RJ1.10(GLO) U1.22(GND) U1.25 U2.2(GND) U3.22(VSS1) U3.28(AVSS_USBHS) U3.29(PVSS_USBHS) U3.30(VSS2_USBHS) U3.33(VSS1_USBHS) U3.35(VSSIO) U3.45(VSS_USB) U3.60(VSS(IO)2) U3.63(VSS(IO/DCDC)) U3.66(VCC_DCDC(IO/DCDC)) U3.83(VSS(IO)3) U3.98(VSS(IO)4) U3.111(VSS(IO)5) U3.124(VSS(IO)6) U3.139(VSS(IO)7) U3.150(VSS(IO)8) U3.153(VREFL) U3.156(AVSS0) U3.157(VREFL0) U3.170(VSS(IO)9) U6.2(E(1)) U7.2(E(1)) U10.2(E(1)) U11.2(E(1)) U12.2(E(1)) U13.2(E(1)) U14.2(E(1)) U15.2(E(1)) U16.2(E(1)) U17.2(E(1)) U22.2(E(1)) U23.2(E(1)) U24.2(E(1)) U25.2(E(1)) U26.2(E(1)) U27.2(E(1)) U34.2(E(1)) U35.2(E(1)) U36.2(E(1)) U37.2(E(1)) U38.2(E(1)) U39.2(E(1)) U46.2(E(1)) U47.2(E(1)) U48.2(E(1)) U49.2(E(1)) U50.2(E(1)) U51.2(E(1)) U58.2(E(1)) U59.2(E(1)) U60.2(E(1)) U61.2(E(1)) U62.2(E(1)) U63.2(E(1)) U70.2(E(1)) U71.2(E(1)) U72.2(E(1)) U73.2(E(1)) U74.2(E(1)) U75.2(E(1)) X1.2 X1.4 X2.2 X2.4
GNDE: J1.S1(SHIELD) J1.S2(SHIELD) J1.S3(SHIELD) J1.S4(SHIELD) J2.P$4 J6.SHLD1(SHIELD_1) J6.SHLD2(SHIELD_2) J7.P$6(SHIELD1) J7.P$7(SHIELD2) J7.P$8(SHIELD3) J7.P$9(SHIELD4) RJ1.13(GNDE0) RJ1.14(GNDE1)
ID: J7.P$4(ID)
IIC_1_SCL: J8.P$8 R14.P$2 U3.132(P1_0)
IIC_1_SDA: J8.P$7 R15.P$2 U3.131(P1_1)
LED1/SPEED: RJ1.11(YLO) U1.23(LED0/ANEN_SPEED)
LS_01: R33.P$2 R34.P$2 U3.50(P2_6) U5.2(E(1))
LS_01_RET: J11.P$1 R28.P$1
LS_02: R36.P$2 R53.P$2 U3.51(P2_5) U8.2(E(1))
LS_02_RET: J12.P$1 R35.P$1
LS_03: R55.P$2 R56.P$2 U3.53(P2_3) U9.2(E(1))
LS_03_RET: J19.P$1 R54.P$1
LS_04: R73.P$2 R74.P$2 U3.54(P2_2) U19.2(E(1))
LS_04_RET: J20.P$1 R60.P$1
LS_05: R58.P$2 R59.P$2 U3.81(P3_5) U18.2(E(1))
LS_05_RET: J27.P$1 R57.P$1
LS_06: R76.P$2 R77.P$2 U3.82(P3_4) U20.2(E(1))
LS_06_RET: J28.P$1 R75.P$1
LS_07: R97.P$2 R98.P$2 U3.86(P3_2) U29.2(E(1))
LS_07_RET: J31.P$1 R84.P$1
LS_08: R82.P$2 R83.P$2 U3.87(P3_1) U28.2(E(1))
LS_08_RET: P1.P$1 R81.P$1
LS_09: R100.P$2 R101.P$2 U3.92(P1_11) U30.2(E(1))
LS_09_RET: P3.P$1 R99.P$1
N$1: C24.P$2 U3.148(VCL2)
N$3: LED1.1(A) R5.P$1
N$4: C33.P$1 U3.19(VCLO)
N$5: C42.P$1 U3.62(VCL1)
N$6: R23.P$2 U3.64(VLO1(DCDC))
N$7: R24.P$2 U3.65(VLO2(DCDC))
N$8: R22.P$2 U3.27(USBHS_RREF)
N$10: R28.P$2 U5.1(B(2))
N$11: LED3.1(A) R33.P$1
N$12: R35.P$2 U8.1(B(2))
N$13: LED6.1(A) R36.P$1
N$14: R39.2 U11.1(B(2))
N$15: R40.2 U12.1(B(2))
N$16: R38.2 U10.1(B(2))
N$17: R45.2 U14.1(B(2))
N$18: R46.2 U15.1(B(2))
N$19: R44.2 U13.1(B(2))
N$20: R29.P$2 U6.1(B(2))
N$21: LED4.2(C) U6.3(C(3)) U$1.P$1(VC-)
N$22: R30.P$2 U7.1(B(2))
N$23: LED5.2(C) U7.3(C(3)) U$2.P$1(VC-)
N$24: LED5.1(A) R31.P$1
N$25: LED4.1(A) R32.P$1
N$26: R63.2 U23.1(B(2))
N$27: R64.2 U24.1(B(2))
N$28: R62.2 U22.1(B(2))
N$29: R69.2 U26.1(B(2))
N$30: R70.2 U27.1(B(2))
N$31: R68.2 U25.1(B(2))
N$32: R54.P$2 U9.1(B(2))
N$33: LED7.1(A) R55.P$1
N$34: R57.P$2 U18.1(B(2))
N$35: LED10.1(A) R58.P$1
N$36: R60.P$2 U19.1(B(2))
N$37: LED11.1(A) R73.P$1
N$38: R87.2 U35.1(B(2))
N$39: R88.2 U36.1(B(2))
N$40: R86.2 U34.1(B(2))
N$41: R93.2 U38.1(B(2))
N$42: R94.2 U39.1(B(2))
N$43: R92.2 U37.1(B(2))
N$44: R49.P$2 U16.1(B(2))
N$45: LED8.2(C) U16.3(C(3)) U$7.P$1(VC-)
N$46: R50.P$2 U17.1(B(2))
N$47: LED9.2(C) U17.3(C(3)) U$8.P$1(VC-)
N$48: LED9.1(A) R51.P$1
N$49: LED8.1(A) R52.P$1
N$50: R111.2 U47.1(B(2))
N$51: R112.2 U48.1(B(2))
N$52: R110.2 U46.1(B(2))
N$53: R117.2 U50.1(B(2))
N$54: R118.2 U51.1(B(2))
N$55: R116.2 U49.1(B(2))
N$56: R75.P$2 U20.1(B(2))
N$57: LED12.1(A) R76.P$1
N$58: R78.P$2 U21.1(B(2))
N$59: LED13.1(A) R79.P$1
N$60: R81.P$2 U28.1(B(2))
N$61: LED14.1(A) R82.P$1
N$62: R135.2 U59.1(B(2))
N$63: R136.2 U60.1(B(2))
N$64: R134.2 U58.1(B(2))
N$65: R141.2 U62.1(B(2))
N$66: R142.2 U63.1(B(2))
N$67: R140.2 U61.1(B(2))
N$68: R84.P$2 U29.1(B(2))
N$69: LED15.1(A) R97.P$1
N$70: R99.P$2 U30.1(B(2))
N$71: LED16.1(A) R100.P$1
N$74: R159.2 U71.1(B(2))
N$75: R160.2 U72.1(B(2))
N$76: R158.2 U70.1(B(2))
N$77: R165.2 U74.1(B(2))
N$78: R166.2 U75.1(B(2))
N$79: R164.2 U73.1(B(2))
N$88: J8.P$20
N$89: J8.P$18
N$90: J8.P$16
N$91: J8.P$14
N$92: J8.P$12
NC: J8.P$6 RJ1.7 U3.79(P3_7) U3.80(P3_6) U3.85(P3_3)
P0_00: J4.P$2 U3.169(P0_0/AN0\00)
P0_01: J4.P$1 U3.168(P0_1/AN001)
P0_02: J39.P$20 R25.P$1 U3.167(P0_2/AN002)
P0_03: J39.P$18 R26.P$1 U3.166(P0_3/PGAVSS000)
P0_04: J39.P$16 R27.P$1 U3.165(P0_4/AN100)
P0_05: J39.P$14 R102.P$1 U3.164(P0_5/AN101)
P0_06: J39.P$12 R103.P$1 U3.163(P0_6/AN102)
P0_07: J39.P$10 R104.P$1 U3.162(P0_7/PGVSS100)
P0_08: J39.P$8 R105.P$1 U3.161(P0_8/AN003)
P0_09: J39.P$6 R106.P$1 U3.160(P0_9/AN004)
P0_14: J39.P$4 R107.P$1 U3.152(P0_14/DA0/AN005/AN105)
P0_15: J39.P$2 R108.P$1 U3.151(P0_15/DA1/AN006/AN106)
P1_02: J8.P$10 U3.130(P1_2)
P1_03: J8.P$9 U3.129(P1_3)
P1_04: J8.P$11 U3.128(P1_4)
P1_05: J8.P$13 U3.127(P1_5)
P1_06: J8.P$15 U3.126(P1_6)
P1_07: J8.P$17 U3.125(P1_7)
P4_00: J4.P$7 U3.1(P4_0)
P4_01: J4.P$8 U3.2(P4_1)
P4_02: J4.P$9 U3.3(P4_2)
P4_08: J4.P$20 U3.43(P4_8)
P4_09: J4.P$19 U3.42(P4_9)
P4_10: J4.P$18 U3.41(P4_10)
P4_11: J4.P$17 U3.40(P4_11)
P4_12: J4.P$16 U3.39(P4_12)
P4_13: J4.P$15 U3.38(P4_13)
P4_14: J4.P$14 U3.37(P4_14)
P4_15: J4.P$13 U3.36(P4_15)
P5_11: J4.P$6 U3.176(P5_11)
P5_12: J4.P$5 U3.175(P5_12)
P5_13: J4.P$4 U3.174(P5_13)
P6_00: J8.P$19 U3.122(P6_0)
P7_06: J4.P$10 U3.14(P7_6)
P7_07: J4.P$11 U3.15(P7_7)
P8_00: J8.P$5 U3.133(P8_0)
P8_01: J8.P$3 U3.134(P8_1)
P8_02: J8.P$4 U3.135(P8_2)
P8_03: J8.P$1 U3.136(P8_3)
P8_04: J8.P$2 U3.137(P8_4)
P8_05: J4.P$3 U3.173(P8_5)
PB_00: J4.P$12 U3.16(PB_0)
R51: R7.P$1 RJ1.12(YHI)
R52: R8.P$1 RJ1.9(GHI)
RELAY_1: R29.P$1 U3.56(P3_14)
RELAY_2: R30.P$1 U3.55(P3_13)
RELAY_3: R49.P$1 U3.52(P2_4)
RELAY_4: R50.P$1 U3.49(P2_7)
RESET: C16.P$1 J3.9 R13.P$1 U3.67(RES#)
REXT: C3.P$1 R1.P$2 U1.9(REXT)
RO_NEG_1: J15.P$2 U$1.P$3(VO-)
RO_NEG_2: J16.P$2 U$2.P$3(VO-)
RO_NEG_3: J23.P$2 U$7.P$3(VO-)
RO_NEG_4: J24.P$2 U$8.P$3(VO-)
RO_POS_1: J15.P$1 U$1.P$4(VO+)
RO_POS_2: J16.P$1 U$2.P$4(VO+)
RO_POS_3: J23.P$1 U$7.P$4(VO+)
RO_POS_4: J24.P$1 U$8.P$4(VO+)
RXD0: R10.P$2 U1.13(RXD0)
RXD1: R9.P$2 U1.12(RXD1)
RXER: R11.P$2 U1.17(RXER)
RXM: RJ1.6(RD-) U1.3(RXM)
RXP: RJ1.3(RD+) U1.4(RXP)
SD1_CD: J1.10(CD_SWITCH2) U3.146(P5_6/AN019)
SD1_CLK: J1.5(CLOCK) U3.140(P5_0/AN016)
SD1_CMD: J1.3(COMMAND/RESPONSE) U3.141(P5_1/AN116)
SD1_DAT0: J1.7(DATA_LINE[BIT_0]) U3.142(P5_2/AN017)
SD1_DAT1: J1.8(DATA_LINE[BIT_1]) U3.143(P5_3/AN117)
SD1_DAT2: J1.1(DATA_LINE[BIT_2]) U3.144(P5_4/AN018)
SD1_DAT3: J1.2(CARD_DETECT/DATA_LINE[BIT_3]) U3.145(P5_5/AN118)
SD1_WP: J1.9(CD_SWITCH1) U3.147(P5_7/AN119)
TCK: J3.7 U3.88(P3_0)
TDI: J3.1 U3.91(P1_10)
TDO: J3.3 U3.90(P1_9)
TMS: J3.5 U3.89(P1_8)
TXM: RJ1.2(TD-) U1.5(TXM)
TXP: RJ1.1(TD+) U1.6(TXP)
USB_N: R17.P$1 U3.46(USB_DM)
USB_P: R18.P$1 U3.47(USB_DP)
USB_VBUS_B: R16.P$1 U3.44(P4_7)
USBHS_FAULT: R19.P$1 U2.3(FLG) U3.78(P3_8)
USBHS_N: J6.D- U3.31(USBHS_DM)
USBHS_P: J6.D+ U3.32(USBHS_DP)
USBHS_VBUS: C29.P$1 C31.1 J6.VBUS U2.5(OUT) U3.17(PB_1)
USBHS_VBUSEN: R20.P$1 U2.1(EN)
VBUS: C28.P$1 J7.P$1(VBUS) R16.P$2 R21.P$2
VCL_F(FLASH): C34.P$2 U3.112(VCL_F(FLASH))
VDD: C4.P$1 C5.P$1 C7.P$1 C14.P$1 C15.P$1 C19.P$2 C20.P$2 C21.P$2 C22.P$2 C25.P$2 C27.P$2 C30.P$2 C35.P$2 C36.P$1 C38.P$2 C39.P$1 C40.P$1 C41.P$1 C43.P$2 FB1.1 J1.4(SUPPLY_VOLTAGE) J3.2 J3.4 L1.2 R2.P$2 R3.P$2 R4.P$2 R5.P$2 R6.P$2 R7.P$2 R8.P$2 R13.P$2 R14.P$1 R15.P$1 R25.P$2 R26.P$2 R27.P$2 R102.P$2 R103.P$2 R104.P$2 R105.P$2 R106.P$2 R107.P$2 R108.P$2 U1.14(VDDIO) U3.25(VCC1) U3.26(AVCC_SUBHS) U3.34(VCC_USBHS) U3.48(VCC_USB) U3.61(VCC(IO)2) U3.84(VCC(IO)3) U3.97(VCC(IO)4) U3.110(VCC(IO)5) U3.123(VCC(IO)6) U3.138(VCC(IO)7) U3.149(VCC(IO)8) U3.154(VREFH) U3.155(AVCC0) U3.158(VREFH0) U3.171(VCC(IO)9)
VDD5: C23.P$1 C26.P$1 J2.P$3 R19.P$2 R20.P$2 R31.P$2 R32.P$2 R51.P$2 R52.P$2 U2.4(VIN) U5.3(C(3)) U8.3(C(3)) U9.3(C(3)) U18.3(C(3)) U19.3(C(3)) U20.3(C(3)) U21.3(C(3)) U28.3(C(3)) U29.3(C(3)) U30.3(C(3)) U$1.P$2(VC+) U$2.P$2(VC+) U$7.P$2(VC+) U$8.P$2(VC+)
VDD12: J9.P$2 J10.P$1 J10.P$2 J11.P$2 J12.P$2 J13.1(1-HLFB+) J13.2(2-INPUT_B+) J13.3(3-INPUT_A+) J13.4(4-ENABLE+) J14.1(1-HLFB+) J14.2(2-INPUT_B+) J14.3(3-INPUT_A+) J14.4(4-ENABLE+) J17.1(1-HLFB+) J17.2(2-INPUT_B+) J17.3(3-INPUT_A+) J17.4(4-ENABLE+) J18.1(1-HLFB+) J18.2(2-INPUT_B+) J18.3(3-INPUT_A+) J18.4(4-ENABLE+) J19.P$2 J20.P$2 J21.1(1-HLFB+) J21.2(2-INPUT_B+) J21.3(3-INPUT_A+) J21.4(4-ENABLE+) J22.1(1-HLFB+) J22.2(2-INPUT_B+) J22.3(3-INPUT_A+) J22.4(4-ENABLE+) J25.1(1-HLFB+) J25.2(2-INPUT_B+) J25.3(3-INPUT_A+) J25.4(4-ENABLE+) J26.1(1-HLFB+) J26.2(2-INPUT_B+) J26.3(3-INPUT_A+) J26.4(4-ENABLE+) J27.P$2 J28.P$2 J29.1(1-HLFB+) J29.2(2-INPUT_B+) J29.3(3-INPUT_A+) J29.4(4-ENABLE+) J30.1(1-HLFB+) J30.2(2-INPUT_B+) J30.3(3-INPUT_A+) J30.4(4-ENABLE+) J31.P$2 J33.1(1-HLFB+) J33.2(2-INPUT_B+) J33.3(3-INPUT_A+) J33.4(4-ENABLE+) J34.1(1-HLFB+) J34.2(2-INPUT_B+) J34.3(3-INPUT_A+) J34.4(4-ENABLE+) P2.P$1 P4.P$1 R37.2 R41.2 R42.2 R43.2 R47.2 R48.2 R61.2 R65.2 R66.2 R67.2 R71.2 R72.2 R85.2 R89.2 R90.2 R91.2 R95.2 R96.2 R109.2 R113.2 R114.2 R115.2 R119.2 R120.2 R133.2 R137.2 R138.2 R139.2 R143.2 R144.2 R157.2 R161.2 R162.2 R163.2 R167.2 R168.2
VDD_1.2: C10.P$1 C11.P$1 U1.1(VDD_1.2)
VDD_ENET1: C8.P$1 C9.P$1 FB1.2 U1.2(VDDA_3.3)
VDDIN: J2.P$2 L1.1
WF_A_DIR: R159.1 U3.99(P6_8)
WF_A_ENABLE: R160.1 U3.96(P1_15)
WF_A_HLFB_OUT: J33.5(5-HLFB-)
WF_A_MI_DIR: J33.7(7-INPUT_A-) R161.1 U71.3(C(3))
WF_A_MI_ENABLE: J33.8(8-ENABLE-) R162.1 U72.3(C(3))
WF_A_MI_STEP: J33.6(6-INPUT_B-) R157.1 U70.3(C(3))
WF_A_STEP: R158.1 U3.100(P6_9)
WF_B_DIR: R165.1 U3.94(P1_13)
WF_B_ENABLE: R166.1 U3.93(P1_12)
WF_B_HLFB_OUT: J34.5(5-HLFB-)
WF_B_MI_ENABLE: J34.8(8-ENABLE-) R168.1 U75.3(C(3))
WF_B_MI_STEP: J34.6(6-INPUT_B-) R163.1 U73.3(C(3))
WF_B_STEP: R164.1 U3.95(P1_14)
X_A_DIR: R39.1 U3.117(P6_5)
X_A_ENABLE: R40.1 U3.116(P6_6)
X_A_HLFB_OUT: J13.5(5-HLFB-)
X_A_MI_DIR: J13.7(7-INPUT_A-) R41.1 U11.3(C(3))
X_A_MI_ENABLE: J13.8(8-ENABLE-) R42.1 U12.3(C(3))
X_A_MI_STEP: J13.6(6-INPUT_B-) R37.1 U10.3(C(3))
X_A_STEP: R38.1 U3.118(P6_4)
X_B_DIR: R45.1 U3.120(P6_2)
X_B_ENABLE: R46.1 U3.119(P6_3)
X_B_HLFB_OUT: J14.5(5-HLFB-)
X_B_MI_DIR: J14.7(7-INPUT_A-) R47.1 U14.3(C(3))
X_B_MI_ENABLE: J14.8(8-ENABLE-) R48.1 U15.3(C(3))
X_B_MI_STEP: J14.6(6-INPUT_B-) R43.1 U13.3(C(3))
X_B_STEP: R44.1 U3.121(P6_1)
XCIN: C32.P$1 U3.20(XCIN) X3.P$1
XCOUT: C37.P$1 U3.21(XCOUT) X3.P$2
XII: C1.P$1 U1.8(XI) X1.1
XOO: C2.P$1 U1.7(XO) X1.3
XTAL1: C17.P$1 U3.23(P2_13/XTAL) X2.1
XTAL2: C18.P$1 U3.24(P2_12/EXTAL) X2.3
Y_A_DIR: R63.1 U3.114(PA_0)
Y_A_ENABLE: R64.1 U3.113(PA_1)
Y_A_HLFB_OUT: J17.5(5-HLFB-)
Y_A_MI_DIR: J17.7(7-INPUT_A-) R65.1 U23.3(C(3))
Y_A_MI_ENABLE: J17.8(8-ENABLE-) R66.1 U24.3(C(3))
Y_A_MI_STEP: J17.6(6-INPUT_B-) R61.1 U22.3(C(3))
Y_A_STEP: R62.1 U3.115(P6_7)
Y_B_DIR: R69.1 U3.108(PA_9)
Y_B_ENABLE: R70.1 U3.107(PA_8)
Y_B_HLFB_OUT: J18.5(5-HLFB-)
Y_B_MI_DIR: J18.7(7-INPUT_A-) R71.1 U26.3(C(3))
Y_B_MI_ENABLE: J18.8(8-ENABLE-) R72.1 U27.3(C(3))
Y_B_MI_STEP: J18.6(6-INPUT_B-) R67.1 U25.3(C(3))
Y_B_STEP: R68.1 U3.109(PA_10)
Z_A_DIR: R87.1 U3.105(P6_14)
Z_A_ENABLE: R88.1 U3.104(P6_13)
Z_A_HLFB_OUT: J21.5(5-HLFB-)
Z_A_MI_DIR: J21.7(7-INPUT_A-) R89.1 U35.3(C(3))
Z_A_MI_ENABLE: J21.8(8-ENABLE-) R90.1 U36.3(C(3))
Z_A_MI_STEP: J21.6(6-INPUT_B-) R85.1 U34.3(C(3))
Z_A_STEP: R86.1 U3.106(P6_15)
Z_B_DIR: R93.1 U3.102(P6_11)
Z_B_ENABLE: R94.1 U3.101(P6_10)
Z_B_HLFB_OUT: J22.5(5-HLFB-)
Z_B_MI_DIR: J22.7(7-INPUT_A-) R95.1 U38.3(C(3))
Z_B_MI_ENABLE: J22.8(8-ENABLE-) R96.1 U39.3(C(3))
Z_B_MI_STEP: J22.6(6-INPUT_B-) R91.1 U37.3(C(3))
Z_B_STEP: R92.1 U3.103(P6_12)
Unconnected: U3.18(VBAT)

## Notes on the sheet
- Power Input | JTAG

## Library data of the parts
AFID1-AFID6 = 3D_MIG_Controller:FIDUCIAL_1MM: For use by pick and place machines to calibrate the vision/machine, 1mm By microbuilder.eu
C1 C2 = 3D_MIG_Controller:C_0402_24PF; PARTNO: CC0402GRNPO9BN240
C3 = 3D_MIG_Controller:C_0402_100PF; PARTNO: CL05C101JB5NNNC
C4 C7 C9 C10 C12 C13 C15 C19 C20 C22 C24-C27 C29 C30 C33-C36 C38-C40 C42 C43 = 3D_MIG_Controller:C_0402_0.1UF; PARTNO: CL05F104ZO5NNNC
C5 C6 C16 C23 = 3D_MIG_Controller:C_0402_10UF; PARTNO: CL05A106MP8NUB8
C8 C14 = 3D_MIG_Controller:C_0402_22UF; PARTNO: CL05A226MQ5N6J8
C11 = 3D_MIG_Controller:C_0402_2.2UF; PARTNO: GRM155C81C225ME15D
C17 C18 = 3D_MIG_Controller:C_0402_18PF; PARTNO: UMK105CG180JV-F
C21 C28 C41 = 3D_MIG_Controller:C_0402_1UF; PARTNO: CL05A105KO5NNNC
C31 = 3D_MIG_Controller:C_1210_100UF_TANT; PARTNO: TLJT107M010R0900
C32 C37 = 3D_MIG_Controller:C_0402_12PF; PARTNO: CL05C120JB5NNNC
FB1 = 3D_MIG_Controller:FB_0603_120_OHM; PARTNO: BLM18PG121SN1D
J1 = 3D_MIG_Controller:SD_CARD_1140084168: Conn; IC Socket; Micro SD; Right Angle; PCB Mount; MicroSD Ser.:: 10 _8 + 2_ Position Card Connector Secure Digital - microSD™ Surface Mount, Right Angle Gold; MF: Amphenol ICC; PARTNO: 114-00841-68; VID: Digikey; VP: 114-00841-68-1-ND; VURL: https://www.digikey.ae/product-detail/en/amphenol-icc-commercial-products/114-00841-68/114-00841-68-1-ND/2187101?utm_source=snapeda&utm_medium=aggregator&utm_campaign=symbol
J2 = 3D_MIG_Controller:3.81MM_1_X_4_RT_ANGLE_PLUG_HEADER: 4 Position Terminal Block Header, Male Pins, Shrouded (4 Side) 0.150" (3.81mm) 90°, Right Angle - Through Hole; PARTNO: 691322310004
J3 = 3D_MIG_Controller:CONN_05X2_RA: Connector Header Through Hole, Right Angle 10 position 0.100" (2.54mm); PARTNO: PH2RA-10-UA
J4 J8 J39 = 3D_MIG_Controller:2_X_10_HEADER_GENERIC: CONN HEADER R/A 20POS 2.54MM, Straight, Right Angle; PARTNO: 67996-420HLF
J6 = 3D_MIG_Controller:USB_A: USB-A Connector Male and female variants, as well as PTH and SMT variants SparkFun Products: SparkFun XBee Explorer Dongle <https://www.sparkfun.com/products/11697> PTH Male SparkFun MicroView-USB Programmer <https://www.sparkfun.com/products/12924> SMT Male SparkFun USB Type A Female Breakout <https://www.sparkfun.com/products/12700> SMT Female; NOZZLE: CN400; PARTNO: 87583-3010RPALF
J7 = 3D_MIG_Controller:USB_MICRO-B; PARTNO: 10118192-0002LF
J9-J12 J15 J16 J19 J20 J23 J24 J27 J28 J31 = 3D_MIG_Controller:3.81MM_1_X_2_RT_ANGLE_PLUG_HEADER: TERM BLOCK HDR 2POS 90DEG 3.81MM; PARTNO: 691322310002
J13 J14 J17 J18 J21 J22 J25 J26 J29 J30 J33 J34 = 3D_MIG_Controller:TEKNIC_MOTOR_8PIN; COPYRIGHT: Copyright (C) 2022 Ultra Librarian. All rights reserved.; MANUFACTURER_PART_NUMBER: 39281083; MFR_NAME: Molex Connector Corporation
L1 = 3D_MIG_Controller:INDUCTOR_1008_2.2_MH_1.3A; PARTNO: LQM2HPN2R2MG0L
LED1 LED3-LED16 = 3D_MIG_Controller:LED_0805_GREEN: Green 570nm LED Indication - Discrete 2.2V 0805 (2012 Metric); PARTNO: LG R971-KN-1
P1-P4 = 3D_MIG_Controller:1_X_1_1MM_PIN
R1 = 3D_MIG_Controller:R_0402_6K49; PARTNO: RMCF0402FT6K49
R2 R3 R13 R19 R20 R23 R24 R34 R53 R56 R59 R74 R77 R80 R83 R98 R101 = 3D_MIG_Controller:R_0402_10K0; PARTNO: RMCF0402JT10K0
R4 R6 = 3D_MIG_Controller:R_0402_1K5; PARTNO: RMCF0402JT1K50
R5 R7 R8 R31-R33 R36 R51 R52 R55 R58 R73 R76 R79 R82 R97 R100 = 3D_MIG_Controller:R_0402_470R0; PARTNO: RMCF0402JT470R
R9-R12 = 3D_MIG_Controller:R_0402_33R0; PARTNO: RMCF0402JT33R0
R14 R15 = 3D_MIG_Controller:R_0402_1K0; PARTNO: CRG0402J1K0
R16 = 3D_MIG_Controller:R_0402_15K0; PARTNO: RMCF0402JT15K0
R17 R18 = 3D_MIG_Controller:R_0402_27R0; PARTNO: RMCF0402JT27R0
R21 = 3D_MIG_Controller:R_0402_30K0; PARTNO: RC0402JR-0730KL
R22 = 3D_MIG_Controller:R_0402_2K2; PARTNO: RMCF0402JT2K20
R25-R30 R35 R49 R50 R54 R57 R60 R75 R78 R81 R84 R99 R102-R108 = 3D_MIG_Controller:R_0402
R37-R48 R61-R72 R85-R96 R109-R120 R133-R144 R157-R168 = 3D_MIG_Controller:R_0805
RJ1 = 3D_MIG_Controller:RJ45_WITH_ELEC; MAN: Shanghai YDS Tech; PARTNO: 13F-64GYD2PL2NL; VENDOR: lcsc.com
U1 = 3D_MIG_Controller:KSZ8081RNACA; PARTNO: KSZ8081RNACA; VENDOR: Micrel
U2 = 3D_MIG_Controller:AP2151DWG-7: Power Switch/Driver 1:1 P-Channel 500mA SOT-25; PARTNO: AP2151WG-7
U3 = 3D_MIG_Controller:RENESAS_S7G2_X_176; PARTNO: R7FS7G27H3A01CFC#AA0
U5-U30 U34-U39 U46-U51 U58-U63 U70-U75 = 3D_MIG_Controller:BC846BW: Bipolar (BJT) Transistor NPN 100MHz Surface Mount SOT-323; PARTNO: BC846BW_NPN
U$1 U$2 U$7 U$8 = 3D_MIG_Controller:RELAY_KYOTO_KF0604D
X1 = 3D_MIG_Controller:XTAL_25_MHZ; PARTNO: FA-238 25.0000MB-B3
X2 = 3D_MIG_Controller:XTAL_24_MHZ; PARTNO: FA-238 24.0000MB-C3
X3 = 3D_MIG_Controller:XTAL_32.768KHZ; PARTNO: ABS07-32.768KHZ-T